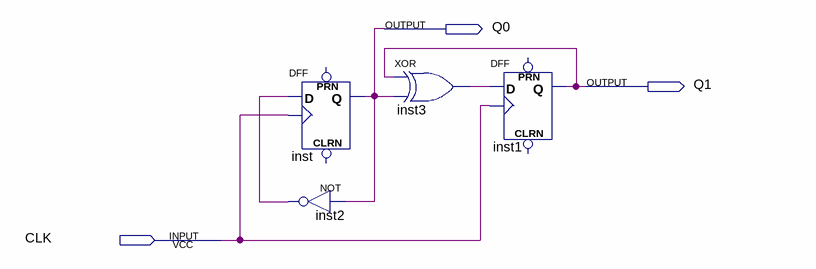
[diagram p0: schematic sheet]
// Quartus schematic two_bit_counter.bdf as structural Verilog: 4 symbols, 3 pins
module two_bit_counter (
  input  CLK,
  output Q0,
  output Q1
);

  wire inst2_out, inst3_out;

  DFF inst (.CLK(CLK), .D(inst2_out), .Q(Q0));  // open: CLRN, PRN
  not inst2 (inst2_out, Q0);
  xor inst3 (inst3_out, Q1, Q0);
  DFF inst1 (.CLK(CLK), .D(inst3_out), .Q(Q1));  // open: CLRN, PRN
endmodule
